# EAGLE schematic Schematic (EAGLE 8.4.0)
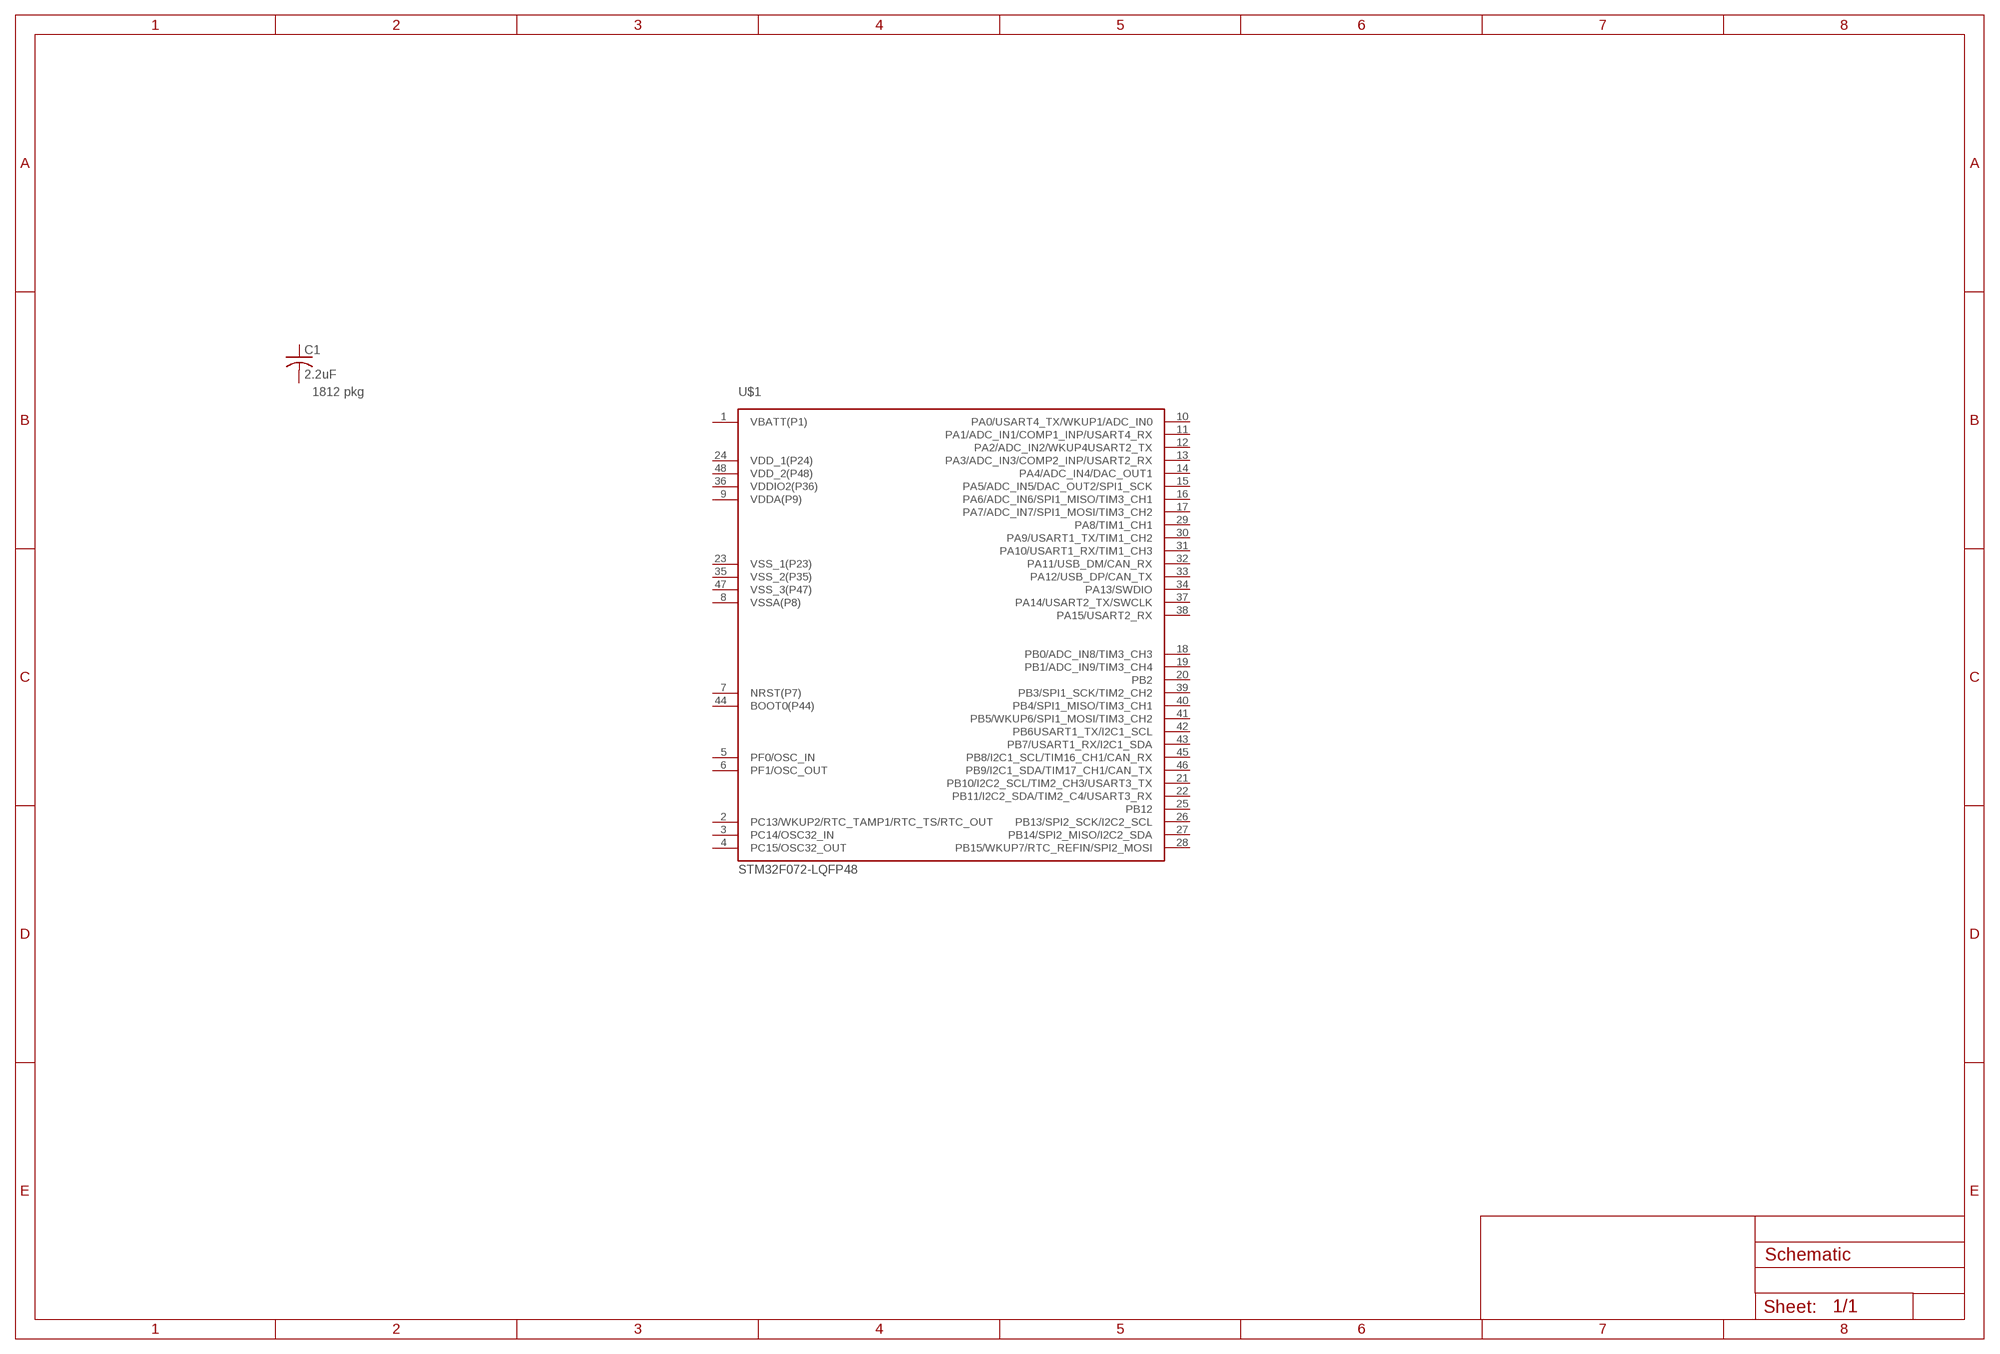
[diagram p0: schematic, sheet 1]

## Parts
C1  2.2uF  C-USC1812  [C1812]
U$1  STM32F072-LQFP48  [LQFP48]
Unconnected: C1.1 C1.2 U$1.1(VBATT(P1)) U$1.2(PC13/WKUP2/RTC_TAMP1/RTC_TS/RTC_OUT) U$1.3(PC14/OSC32_IN) U$1.4(PC15/OSC32_OUT) U$1.5(PF0/OSC_IN) U$1.6(PF1/OSC_OUT) U$1.7(NRST(P7)) U$1.8(VSSA(P8)) U$1.9(VDDA(P9)) U$1.10(PA0/USART4_TX/WKUP1/ADC_IN0) U$1.11(PA1/ADC_IN1/COMP1_INP/USART4_RX) U$1.12(PA2/ADC_IN2/WKUP4USART2_TX) U$1.13(PA3/ADC_IN3/COMP2_INP/USART2_RX) U$1.14(PA4/ADC_IN4/DAC_OUT1) U$1.15(PA5/ADC_IN5/DAC_OUT2/SPI1_SCK) U$1.16(PA6/ADC_IN6/SPI1_MISO/TIM3_CH1) U$1.17(PA7/ADC_IN7/SPI1_MOSI/TIM3_CH2) U$1.18(PB0/ADC_IN8/TIM3_CH3) U$1.19(PB1/ADC_IN9/TIM3_CH4) U$1.20(PB2) U$1.21(PB10/I2C2_SCL/TIM2_CH3/USART3_TX) U$1.22(PB11/I2C2_SDA/TIM2_C4/USART3_RX) U$1.23(VSS_1(P23)) U$1.24(VDD_1(P24)) U$1.25(PB12) U$1.26(PB13/SPI2_SCK/I2C2_SCL) U$1.27(PB14/SPI2_MISO/I2C2_SDA) U$1.28(PB15/WKUP7/RTC_REFIN/SPI2_MOSI) U$1.29(PA8/TIM1_CH1) U$1.30(PA9/USART1_TX/TIM1_CH2) U$1.31(PA10/USART1_RX/TIM1_CH3) U$1.32(PA11/USB_DM/CAN_RX) U$1.33(PA12/USB_DP/CAN_TX) U$1.34(PA13/SWDIO) U$1.35(VSS_2(P35)) U$1.36(VDDIO2(P36)) U$1.37(PA14/USART2_TX/SWCLK) U$1.38(PA15/USART2_RX) U$1.39(PB3/SPI1_SCK/TIM2_CH2) U$1.40(PB4/SPI1_MISO/TIM3_CH1) U$1.41(PB5/WKUP6/SPI1_MOSI/TIM3_CH2) U$1.42(PB6USART1_TX/I2C1_SCL) U$1.43(PB7/USART1_RX/I2C1_SDA) U$1.44(BOOT0(P44)) U$1.45(PB8/I2C1_SCL/TIM16_CH1/CAN_RX) U$1.46(PB9/I2C1_SDA/TIM17_CH1/CAN_TX) U$1.47(VSS_3(P47)) U$1.48(VDD_2(P48))

## Notes on the sheet
- 1812 pkg

## Library data of the parts
C1 = rcl:C-US: CAPACITOR, American symbol
U$1 = stm32f0:STM32F072